# EAGLE design Core-ESP32 (EAGLE 7.7.0)

## Sheet 1 of 2
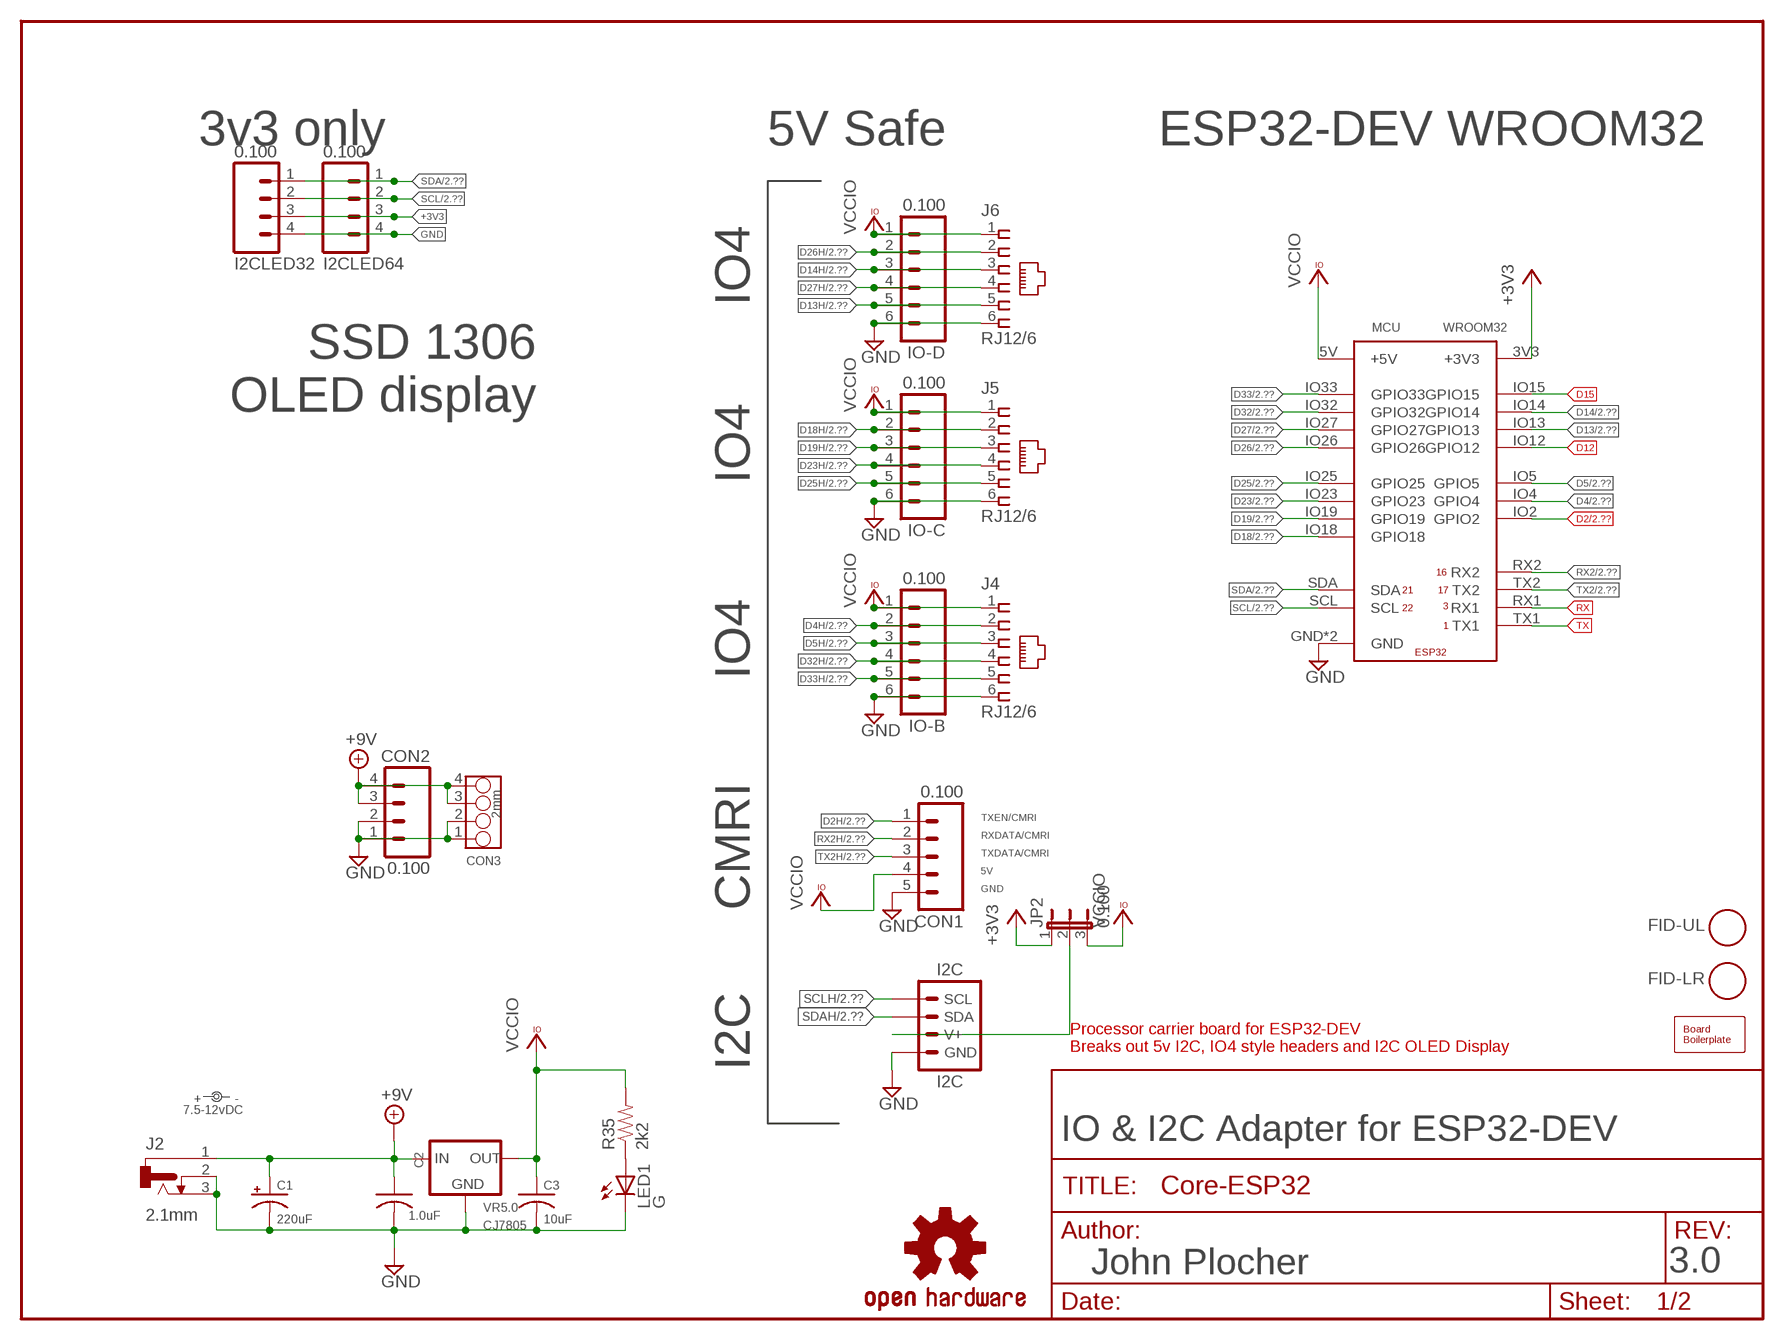
[diagram p0: schematic, sheet 1]

### Parts
BOARD  BOARD  BOARD80X100-IOB  [BOARD-DINRAIL-3.17IN-IOB]
C1  220uF  CAP-POL0810  [0810-CAP]
C2  1.0uF  CAP0603  [0603-CAP]
C3  10uF  CAP0603  [0603-CAP]
CON1  0.100  CONNECTOR-M05LOCK  [1X05_LOCK]
CON2  0.100  CONNECTOR-M04LOCK  [1X04_LOCK]
CON3  2mm  CONNECTOR-GROVE-4P-2.0-3470130P1  [4P-2.0]
FID-LR  FIDUCIAL  [FIDUCIAL_1MM]
FID-UL  FIDUCIAL  [FIDUCIAL_1MM]
I2C  I2C  CONNECTOR-I2CLEFT  [I2C-L]
I2CLED32  0.100  CONNECTOR-M04LOCK  [1X04_LOCK]
I2CLED64  0.100  CONNECTOR-M04LOCK  [1X04_LOCK]
IO-B  0.100  CONNECTOR-M06LOCK  [1X06_LOCK]
IO-C  0.100  CONNECTOR-M06LOCK  [1X06_LOCK]
IO-D  0.100  CONNECTOR-M06LOCK  [1X06_LOCK]
J2  2.1mm  CONNECTOR-DC-POWER-RA  [DCJ0202]
J4  RJ12/6  CONNECTOR-RJ25-43860-2-MOLEX  [RJ25-INVERTED]
J5  RJ12/6  CONNECTOR-RJ25-43860-2-MOLEX  [RJ25-INVERTED]
J6  RJ12/6  CONNECTOR-RJ25-43860-2-MOLEX  [RJ25-INVERTED]
JP2  0.100  JUMPER-3PTH-LOCK  [1X03]
LABEL1  7.5-12vDC  DOC-POWER_LABEL  [PWR_LABEL]
LED1  G  LED0603-LED  [0603-LED]
MCU  WROOM32  ESP32/DEV  [ESP32-DEV]
OSHW1  OSHW  OSHW-LOGOL  [OSHW-LOGO-L]
R35  2k2  R0603-RES  [0603-RES]
VR5.0  CJ7805  VREG-DPAK-5  [TO-252]

### Nets
+3V3: I2CLED32.3 I2CLED64.3 JP2.1 MCU.3V3(+3V3) ; also sheet 2
+9V [Feed]: C1.+ C2.1 CON2.3 CON2.4 CON3.3 CON3.4 J2.1 VR5.0.1(IN)
D2 [signals]: MCU.IO2(GPIO2) ; also sheet 2
D2H [signals]: CON1.1 ; also sheet 2
D4 [signals]: MCU.IO4(GPIO4) ; also sheet 2
D4H [signals]: IO-B.2 J4.2 ; also sheet 2
D5 [signals]: MCU.IO5(GPIO5) ; also sheet 2
D5H [signals]: IO-B.3 J4.3 ; also sheet 2
D12 [signals]: MCU.IO12(GPIO12)
D13 [signals]: MCU.IO13(GPIO13) ; also sheet 2
D13H [signals]: IO-D.5 J6.5 ; also sheet 2
D14 [signals]: MCU.IO14(GPIO14) ; also sheet 2
D14H [signals]: IO-D.3 J6.3 ; also sheet 2
D15 [signals]: MCU.IO15(GPIO15)
D18: MCU.IO18(GPIO18) ; also sheet 2
D18H [signals]: IO-C.2 J5.2 ; also sheet 2
D19: MCU.IO19(GPIO19) ; also sheet 2
D19H [signals]: IO-C.3 J5.3 ; also sheet 2
D23: MCU.IO23(GPIO23) ; also sheet 2
D23H [signals]: IO-C.4 J5.4 ; also sheet 2
D25 [signals]: MCU.IO25(GPIO25) ; also sheet 2
D25H [signals]: IO-C.5 J5.5 ; also sheet 2
D26 [signals]: MCU.IO26(GPIO26) ; also sheet 2
D26H [signals]: IO-D.2 J6.2 ; also sheet 2
D27 [signals]: MCU.IO27(GPIO27) ; also sheet 2
D27H [signals]: IO-D.4 J6.4 ; also sheet 2
D32: MCU.IO32(GPIO32) ; also sheet 2
D32H [signals]: IO-B.4 J4.4 ; also sheet 2
D33: MCU.IO33(GPIO33) ; also sheet 2
D33H [signals]: IO-B.5 J4.5 ; also sheet 2
GND [signals]: C1.- C2.2 C3.2 CON1.5 CON2.1 CON2.2 CON3.1 CON3.2 I2C.GND I2C.GND@1(GND) I2CLED32.4 I2CLED64.4 IO-B.6 IO-C.6 IO-D.6 J2.2 J2.3 J4.6 J5.6 J6.6 LED1.C MCU.GND MCU.GND@1(GND) VR5.0.2(GND)
N$1: LED1.A R35.1
N$3 [Power]: I2C.V+ I2C.V+@1(V+) JP2.2
RX [signals]: MCU.RX1
RX2 [signals]: MCU.RX2 ; also sheet 2
RX2H [signals]: CON1.2 ; also sheet 2
SCL [signals]: I2CLED32.2 I2CLED64.2 MCU.SCL ; also sheet 2
SCLH [signals]: I2C.SCL I2C.SCL@1(SCL) ; also sheet 2
SDA [signals]: I2CLED32.1 I2CLED64.1 MCU.SDA ; also sheet 2
SDAH [signals]: I2C.SDA I2C.SDA@1(SDA) ; also sheet 2
TX [signals]: MCU.TX1
TX2 [signals]: MCU.TX2 ; also sheet 2
TX2H [signals]: CON1.3 ; also sheet 2
VCCIO [Power]: C3.1 CON1.4 IO-B.1 IO-C.1 IO-D.1 J4.1 J5.1 J6.1 JP2.3 MCU.5V(+5V) R35.2 VR5.0.3(OUT) ; also sheet 2

### Notes on the sheet
- 3v3 only | 5V Safe | ESP32-DEV WROOM32
- IO4
- SSD 1306
  OLED display
- IO4
- IO4
- TXEN/CMRI
- RXDATA/CMRI
- TXDATA/CMRI
- 5V
- GND
- CMRI
- Processor carrier board for ESP32-DEV
  Breaks out 5v I2C, IO4 style headers and I2C OLED Display
- I2C
- IO & I2C Adapter for ESP32-DEV
- John Plocher | 3.0

## Sheet 2 of 2
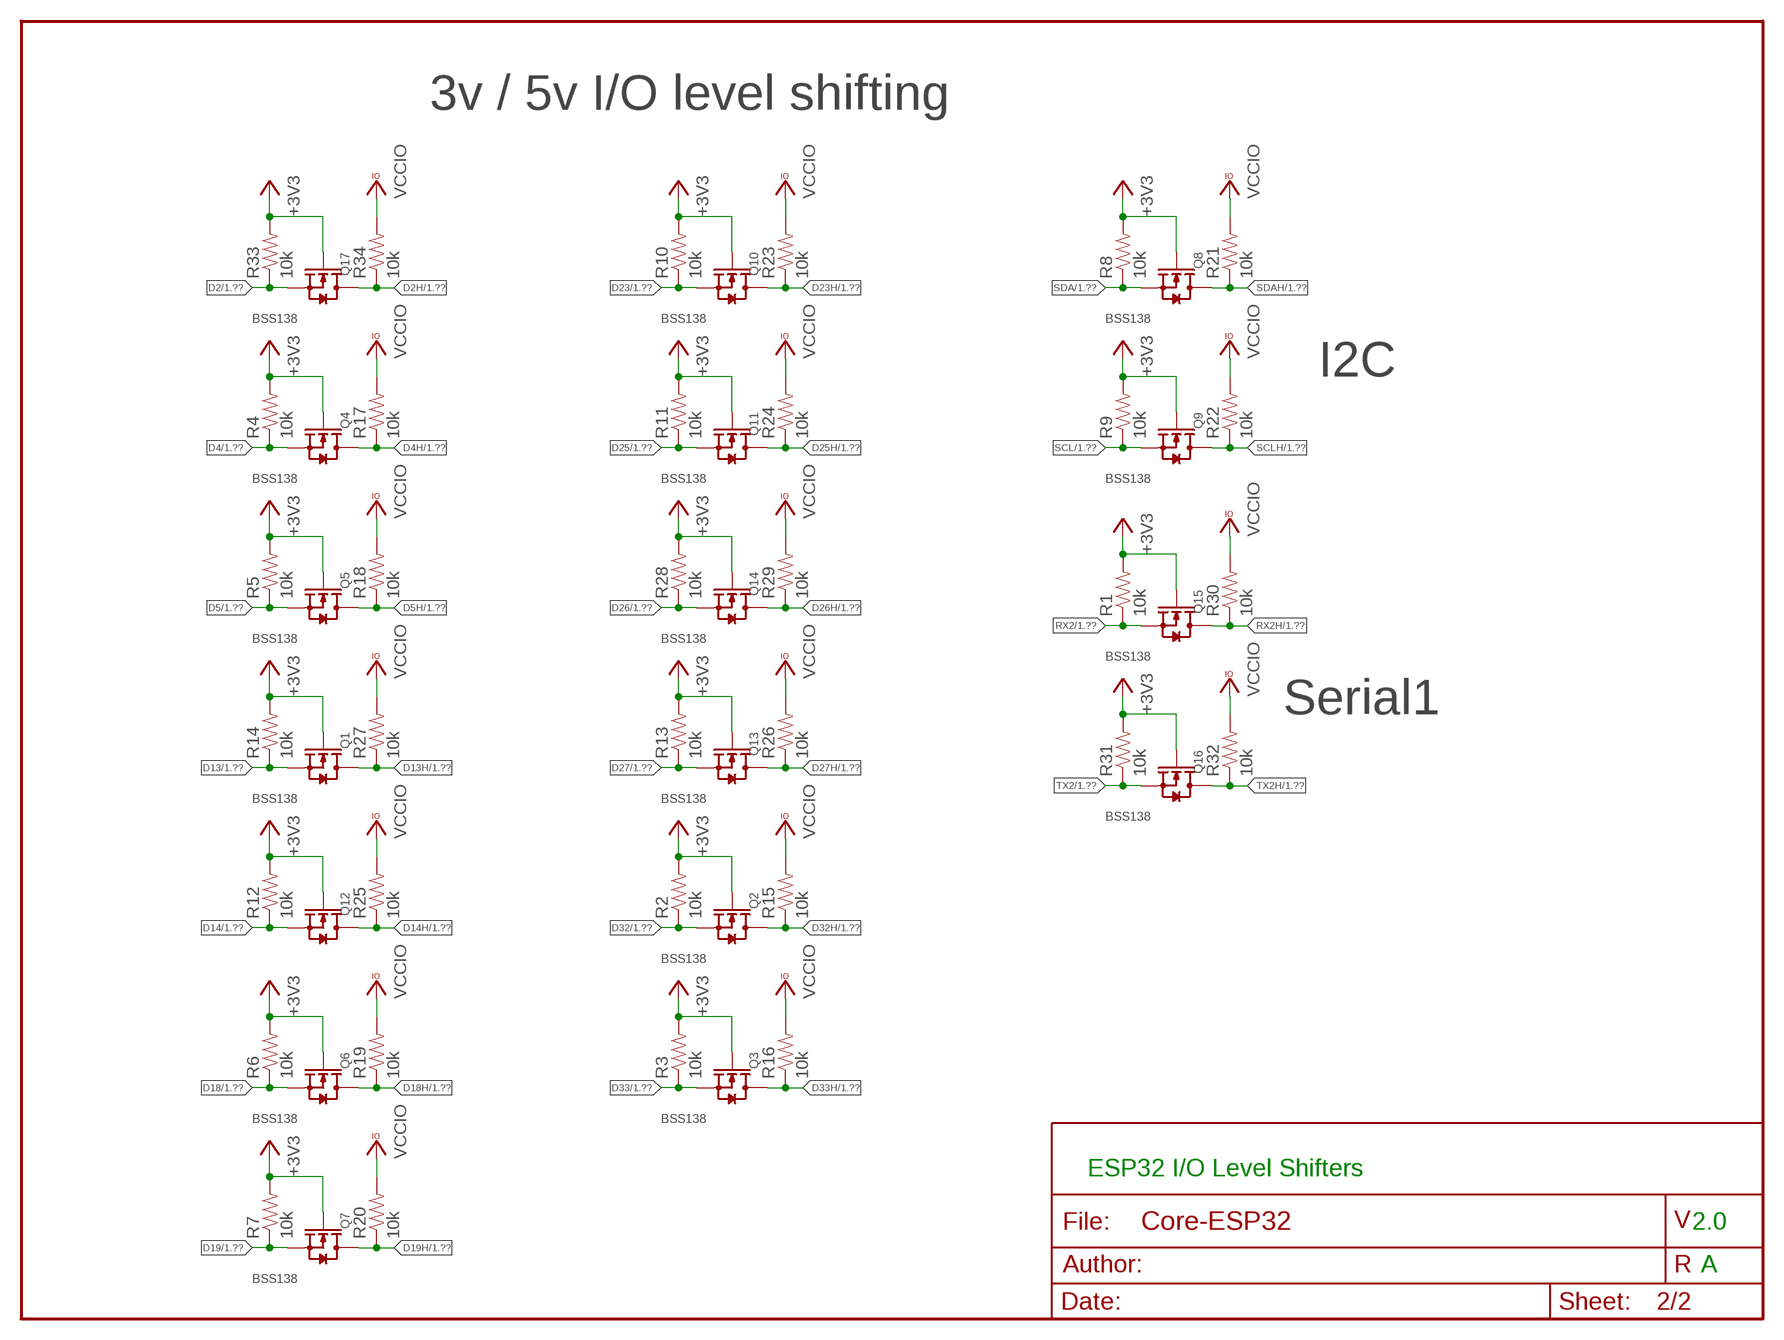
[diagram p1: schematic, sheet 2]

### Parts
Q1  BSS138  MOSFET-N-BSS138-SOT23  [SOT23]
Q2  BSS138  MOSFET-N-BSS138-SOT23  [SOT23]
Q3  BSS138  MOSFET-N-BSS138-SOT23  [SOT23]
Q4  BSS138  MOSFET-N-BSS138-SOT23  [SOT23]
Q5  BSS138  MOSFET-N-BSS138-SOT23  [SOT23]
Q6  BSS138  MOSFET-N-BSS138-SOT23  [SOT23]
Q7  BSS138  MOSFET-N-BSS138-SOT23  [SOT23]
Q8  BSS138  MOSFET-N-BSS138-SOT23  [SOT23]
Q9  BSS138  MOSFET-N-BSS138-SOT23  [SOT23]
Q10  BSS138  MOSFET-N-BSS138-SOT23  [SOT23]
Q11  BSS138  MOSFET-N-BSS138-SOT23  [SOT23]
Q12  BSS138  MOSFET-N-BSS138-SOT23  [SOT23]
Q13  BSS138  MOSFET-N-BSS138-SOT23  [SOT23]
Q14  BSS138  MOSFET-N-BSS138-SOT23  [SOT23]
Q15  BSS138  MOSFET-N-BSS138-SOT23  [SOT23]
Q16  BSS138  MOSFET-N-BSS138-SOT23  [SOT23]
Q17  BSS138  MOSFET-N-BSS138-SOT23  [SOT23]
R1  10k  R0603-RES  [0603-RES]
R2  10k  R0603-RES  [0603-RES]
R3  10k  R0603-RES  [0603-RES]
R4  10k  R0603-RES  [0603-RES]
R5  10k  R0603-RES  [0603-RES]
R6  10k  R0603-RES  [0603-RES]
R7  10k  R0603-RES  [0603-RES]
R8  10k  R0603-RES  [0603-RES]
R9  10k  R0603-RES  [0603-RES]
R10  10k  R0603-RES  [0603-RES]
R11  10k  R0603-RES  [0603-RES]
R12  10k  R0603-RES  [0603-RES]
R13  10k  R0603-RES  [0603-RES]
R14  10k  R0603-RES  [0603-RES]
R15  10k  R0603-RES  [0603-RES]
R16  10k  R0603-RES  [0603-RES]
R17  10k  R0603-RES  [0603-RES]
R18  10k  R0603-RES  [0603-RES]
R19  10k  R0603-RES  [0603-RES]
R20  10k  R0603-RES  [0603-RES]
R21  10k  R0603-RES  [0603-RES]
R22  10k  R0603-RES  [0603-RES]
R23  10k  R0603-RES  [0603-RES]
R24  10k  R0603-RES  [0603-RES]
R25  10k  R0603-RES  [0603-RES]
R26  10k  R0603-RES  [0603-RES]
R27  10k  R0603-RES  [0603-RES]
R28  10k  R0603-RES  [0603-RES]
R29  10k  R0603-RES  [0603-RES]
R30  10k  R0603-RES  [0603-RES]
R31  10k  R0603-RES  [0603-RES]
R32  10k  R0603-RES  [0603-RES]
R33  10k  R0603-RES  [0603-RES]
R34  10k  R0603-RES  [0603-RES]

### Nets
+3V3: Q1.1(G) Q2.1(G) Q3.1(G) Q4.1(G) Q5.1(G) Q6.1(G) Q7.1(G) Q8.1(G) Q9.1(G) Q10.1(G) Q11.1(G) Q12.1(G) Q13.1(G) Q14.1(G) Q15.1(G) Q16.1(G) Q17.1(G) R1.2 R2.2 R3.2 R4.2 R5.2 R6.2 R7.2 R8.2 R9.2 R10.2 R11.2 R12.2 R13.2 R14.2 R28.2 R31.2 R33.2 ; also sheet 1
D2 [signals]: Q17.2(S) R33.1 ; also sheet 1
D2H [signals]: Q17.3(D) R34.1 ; also sheet 1
D4 [signals]: Q4.2(S) R4.1 ; also sheet 1
D4H [signals]: Q4.3(D) R17.1 ; also sheet 1
D5 [signals]: Q5.2(S) R5.1 ; also sheet 1
D5H [signals]: Q5.3(D) R18.1 ; also sheet 1
D13 [signals]: Q1.2(S) R14.1 ; also sheet 1
D13H [signals]: Q1.3(D) R27.1 ; also sheet 1
D14 [signals]: Q12.2(S) R12.1 ; also sheet 1
D14H [signals]: Q12.3(D) R25.1 ; also sheet 1
D18: Q6.2(S) R6.1 ; also sheet 1
D18H [signals]: Q6.3(D) R19.1 ; also sheet 1
D19: Q7.2(S) R7.1 ; also sheet 1
D19H [signals]: Q7.3(D) R20.1 ; also sheet 1
D23: Q10.2(S) R10.1 ; also sheet 1
D23H [signals]: Q10.3(D) R23.1 ; also sheet 1
D25 [signals]: Q11.2(S) R11.1 ; also sheet 1
D25H [signals]: Q11.3(D) R24.1 ; also sheet 1
D26 [signals]: Q14.2(S) R28.1 ; also sheet 1
D26H [signals]: Q14.3(D) R29.1 ; also sheet 1
D27 [signals]: Q13.2(S) R13.1 ; also sheet 1
D27H [signals]: Q13.3(D) R26.1 ; also sheet 1
D32: Q2.2(S) R2.1 ; also sheet 1
D32H [signals]: Q2.3(D) R15.1 ; also sheet 1
D33: Q3.2(S) R3.1 ; also sheet 1
D33H [signals]: Q3.3(D) R16.1 ; also sheet 1
RX2 [signals]: Q15.2(S) R1.1 ; also sheet 1
RX2H [signals]: Q15.3(D) R30.1 ; also sheet 1
SCL [signals]: Q9.2(S) R9.1 ; also sheet 1
SCLH [signals]: Q9.3(D) R22.1 ; also sheet 1
SDA [signals]: Q8.2(S) R8.1 ; also sheet 1
SDAH [signals]: Q8.3(D) R21.1 ; also sheet 1
TX2 [signals]: Q16.2(S) R31.1 ; also sheet 1
TX2H [signals]: Q16.3(D) R32.1 ; also sheet 1
VCCIO [Power]: R15.2 R16.2 R17.2 R18.2 R19.2 R20.2 R21.2 R22.2 R23.2 R24.2 R25.2 R26.2 R27.2 R29.2 R30.2 R32.2 R34.2 ; also sheet 1

### Notes on the sheet
- 3v / 5v I/O level shifting
- I2C
- Serial1
- ESP32 I/O Level Shifters
- 2.0
- A

## Library data of the parts
BOARD = SPCoast:BOARD
C1 = SPCoast:CAP-POL*
C2 C3 = SPCoast:CAP*
CON1 = SPCoast:CONNECTOR-M05: Header 5 Standard 5-pin 0.1" header. Use with straight break away headers (SKU : PRT-00116), right angle break away headers (PRT-00553), swiss pins (PRT-00743), machine pins (PRT-00117), and female headers (PRT-00115). Molex polarized connector foot print use with SKU : PRT-08230 with associated crimp pins and housings.
CON2 I2CLED32 I2CLED64 = SPCoast:CONNECTOR-M04: Header 4 Standard 4-pin 0.1" header. Use with straight break away headers (SKU : PRT-00116), right angle break away headers (PRT-00553), swiss pins (PRT-00743), machine pins (PRT-00117), and female headers (PRT-00115). Molex polarized connector foot print use with SKU : PRT-08231 with associated crimp pins and housings. 1MM SMD Version SKU: PRT-10208
CON3 = SPCoast:CONNECTOR-GROVE-4P-2.0
FID-LR FID-UL = SPCoast:FIDUCIAL: For use by pick and place machines to calibrate the vision/machine, 1mm By microbuilder.eu
I2C = SPCoast:CONNECTOR-I2C
IO-B IO-C IO-D = SPCoast:CONNECTOR-M06: Header 6 Standard 6-pin 0.1" header
J2 = SPCoast:CONNECTOR-DC-POWER: DC POWER JACK
J4-J6 = SPCoast:CONNECTOR-RJ25: AMP connector
JP2 = SPCoast:JUMPER-3
LABEL1 = SPCoast:DOC-POWER_LABEL
LED1 = SPCoast:LED*
MCU = SPCoast:ESP32: https://www.banggood.com/ESP32-Development-Board-WiFiBluetooth-Ultra-Low-Power-Consumption-Dual-Cores-ESP-32-ESP-32S-Board-p-1109512.html
OSHW1 = SparkFun:OSHW-LOGO: Open Source Hardware Logo This logo indicates the piece of hardware it is found on incorporates a OSHW license and/or adheres to the definition of open source hardware found here: http://freedomdefined.org/OSHW
Q1-Q17 = SPCoast:MOSFET-N-*-?: CJ2302：SMD MOSFET N-CH 20V-2.1A DMN4468 - SO8 30v/10A
R1-R35 = SPCoast:R*: Resistor Basic schematic elements and footprints for 0603, 1206, and PTH 1/10th watt (small) resistors.
VR5.0 = SPCoast:VREG-?-*: Voltage Regulator Standard linear regulator. 7805 uses IGO pinout LM1117 uses GOI pinout

## Net classes
0 default: width 0.203 mm, drill 0.5 mm, clearance 0.203 mm
1 Power: width 0.406 mm, drill 0.8 mm, clearance 0.254 mm
2 signals: width 0.254 mm, drill 0.6 mm, clearance 0.254 mm
3 Feed: width 1.016 mm, drill 1.4 mm, clearance 0.254 mm

## Board
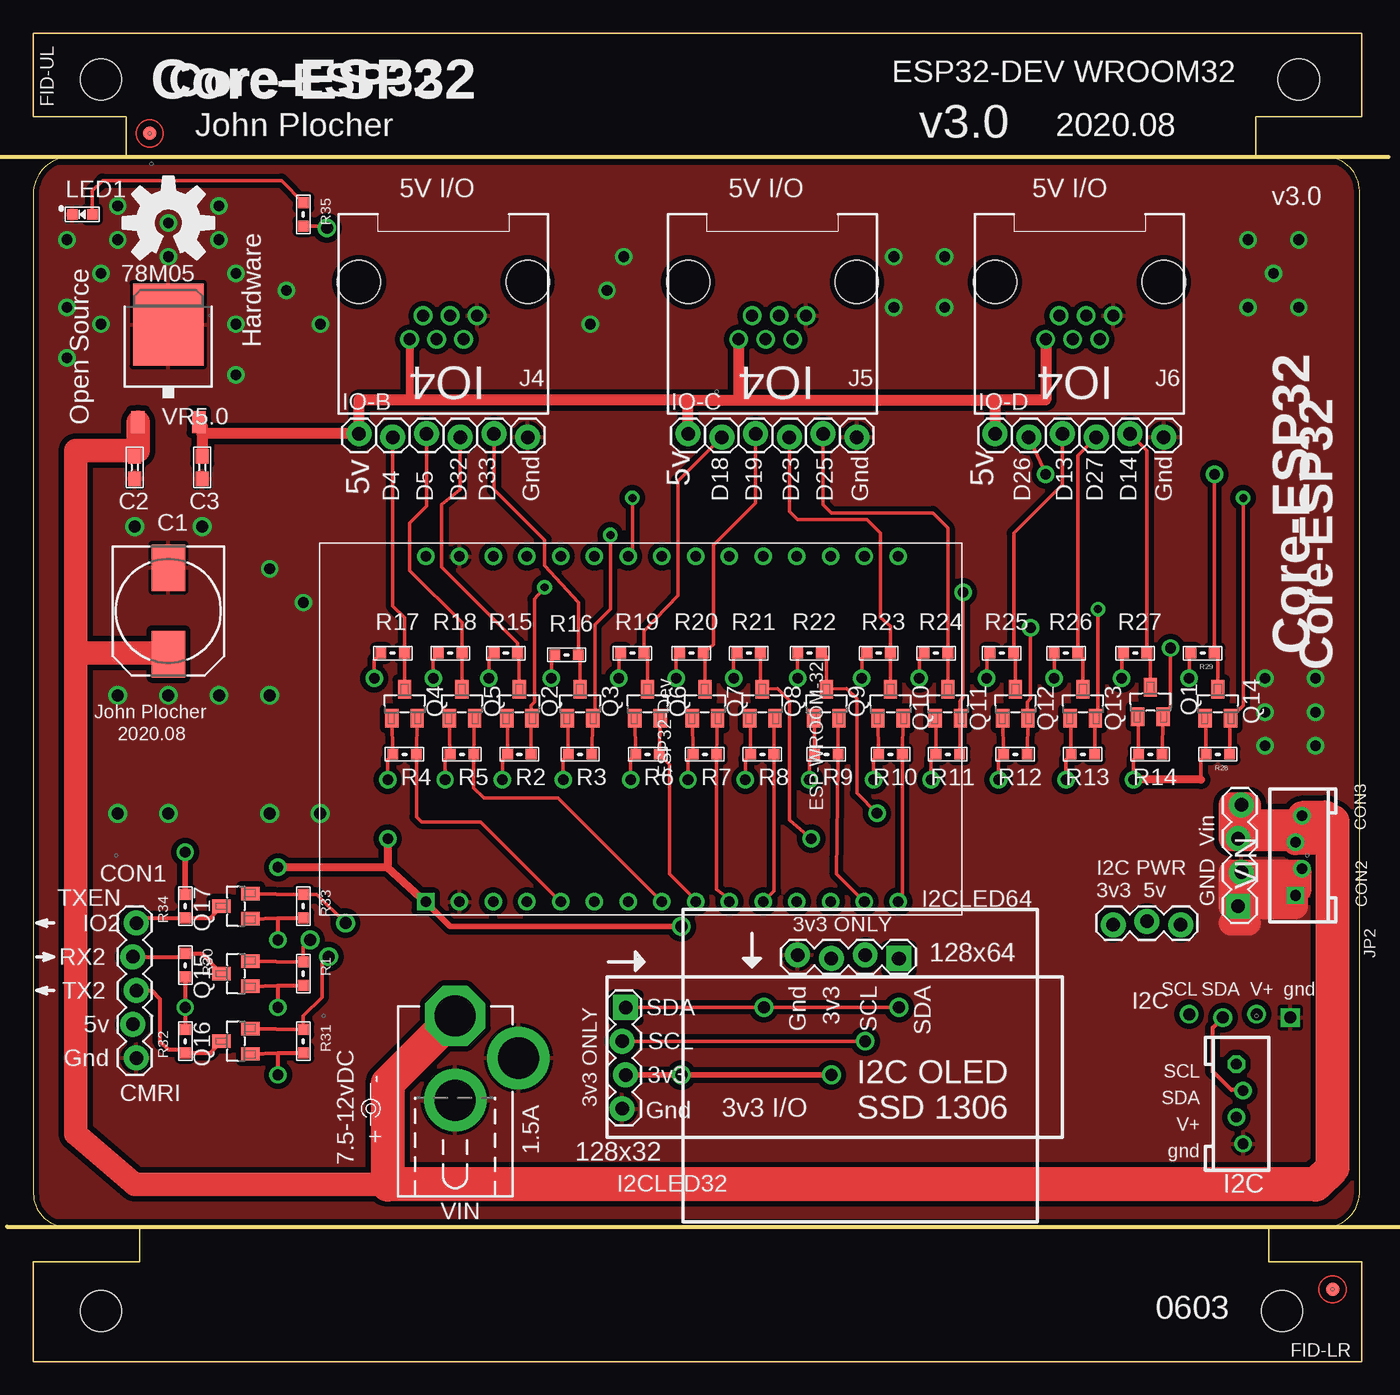
[diagram p2: board, top side]
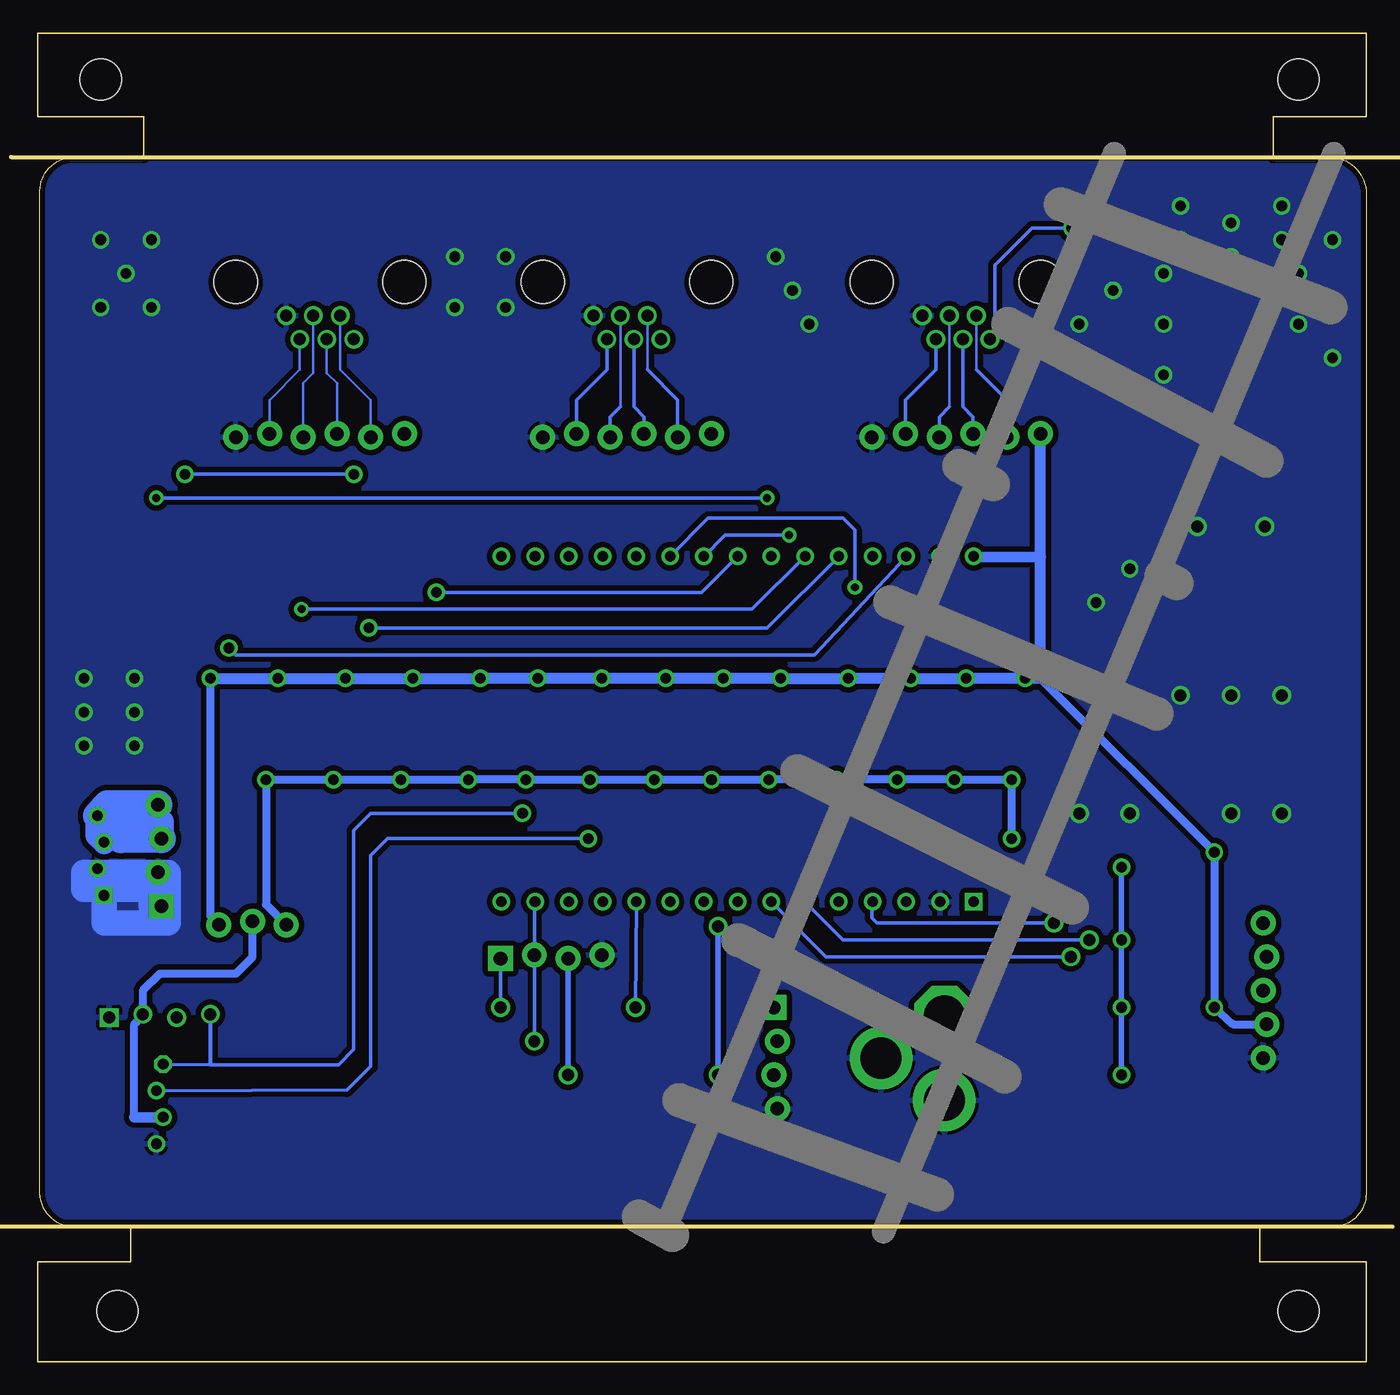
[diagram p3: board, bottom side, seen from below]

Size 100.01 x 100 mm. Coordinates in mm from the lower left corner, seen from the top.
Copper layers (1*16): Top 0.035mm / dielectric 1.5mm / Bottom 0.035mm
Design rules "Fusion_eagle_rule_v1.1 *": minimum track width 8mil, minimum drill 0.6mm, track to track 6mil, track to pad 6mil, pad to pad 10mil, via to via 10mil, smd to smd 10mil, copper to edge 10mil, drill to drill 10mil, minimum pad ring 10mil, minimum via ring 10mil, stop-mask expansion 2mil, vias tented up to drill 100mil, thermal gap 10mil

### Footprints (pad centres in the part's own frame; a part is rotated, then mirrored left to right if it is on the bottom)
BOARD-DINRAIL-3.17IN-IOB = hole 3.1: 5.08,96.52; 95.25,96.52; 5.08,3.81; 93.98,3.81
0810-CAP = smd 3.5 x 2.5: + 3.25,0; - -3.25,0
0603-CAP = smd 1.1 x 1: 1 -0.85,0; 2 0.85,0
1X05_LOCK = drill 1.016 pad 1.88: 1 0,0.127; 2 2.54,-0.127; 3 5.08,0.127; 4 7.62,-0.127; 5 10.16,0.127
1X04_LOCK = drill 1.016 pad 1.88 square: 1 0,0.127 | drill 1.016 pad 1.88: 2 2.54,-0.127; 3 5.08,0.127; 4 7.62,-0.127
4P-2.0 = drill 0.8 pad 1.27 square: 1 -3,0.254 | drill 0.8 pad 1.27: 2 -1,-0.254; 3 1,0.254; 4 3,-0.254
FIDUCIAL_1MM = smd 1 x 1: 1 0,0
I2C-L = drill 0.9 square: GND 3.81,-0.127 | drill 0.8 pad 1.27: GND@1 0.254,-9.635; SDA@1 0.254,-5.635; V+@1 -0.254,-7.635 | drill 0.9: SCL -3.81,0.127; SDA -1.27,-0.127; V+ 1.27,0.127 | drill 0.8 pad 1.27 octagon: SCL@1 -0.254,-3.635
1X06_LOCK = drill 1.016 pad 1.88: 1 0,0; 2 2.54,-0.254; 3 5.08,0; 4 7.62,-0.254; 5 10.16,0; 6 12.7,-0.254
DCJ0202 = drill 3.1 pad 4.5 octagon: 1 0,3.175 | drill 3.1 pad 4.7: 2 4.763,0; 3 0,-3.175
RJ25-INVERTED = drill 0.9 pad 1.4: 1 2.54,4.318; 2 1.524,2.54; 3 0.508,4.318; 4 -0.508,2.54; 5 -1.524,4.318; 6 -2.54,2.54 | hole 3.251: -6.35,0; 6.35,0
1X03 = drill 1.016 pad 1.88: 1 0,-0.127; 2 2.54,0.127; 3 5.08,-0.127
0603-LED = smd 0.8 x 0.8: A 0.75,0; C -0.75,0
ESP32-DEV = drill 0.8 square: 3V3 13,-20 | drill 0.8: 5V -13,-20; EN -13,15.56; GND -13,-17.46; GND@1 13,-17.46; IO2 13,-12.38; IO4 13,-9.84; IO5 13,-2.22; IO12 -13,-12.38; IO13 -13,-14.92; IO14 -13,-9.84; IO15 13,-14.92; IO18 13,0.32; IO19 13,2.86; IO23 13,15.56; IO25 -13,-2.22; IO26 -13,-4.76; IO27 -13,-7.3; IO32 -13,2.86; IO33 -13,0.32; IO34 -13,7.94; IO35 -13,5.4; RX1 13,7.94; RX2 13,-7.3; SCL 13,13.02; SDA 13,5.4; TX1 13,10.48; TX2 13,-4.76; VN -13,10.48; VP -13,13.02
SOT23 = smd 1.4 x 1: 1 1.1,-0.95; 2 1.1,0.95; 3 -1.1,0
0603-RES = smd 0.813 x 0.813: 1 -0.889,0; 2 0.889,0
TO-252 = smd 1.651 x 1.016: 1 -4.826,2.286; 3 -4.826,-2.286 | smd 6.2 x 5.3: 2 2.5,0

### Placement (x,y rotation side)
BOARD  0.01,0 0 top
C1  10.17,56.52 270 top
C2  7.63,67.31 270 top
C3  12.71,67.31 270 top
CON1  7.63,33.02 270 top
CON2  90.82,34.29 90 top
CON3  95.26,38.1 90 top
FID-LR  97.8,5.46 0 top
FID-UL  8.78,92.46 0 top
I2C  90.82,26.04 0 top
I2CLED32  44.46,26.67 270 top
I2CLED64  65.16,30.48 180 top
IO-B  24.52,69.85 0 top
IO-C  49.29,69.85 0 top
IO-D  72.4,69.85 0 top
J2  31.76,22.86 0 top
J4  30.87,81.28 180 top
J5  55.64,81.28 180 top
J6  78.75,81.28 180 top
JP2  81.29,33.02 0 top
LABEL1  25.41,19.05 180 top
LED1  3.7,86.36 0 top
MCU  49.54,47.62 270 top
OSHW1  10.17,85.72 0 top
Q1  84.09,49.66 270 top
Q2  36.59,49.53 270 top
Q3  41.16,49.53 270 top
Q4  27.95,49.53 270 top
Q5  32.27,49.53 270 top
Q6  46.24,49.53 270 top
Q7  50.56,49.53 270 top
Q8  54.88,49.53 270 top
Q9  59.7,49.53 270 top
Q10  64.53,49.53 270 top
Q11  68.85,49.53 270 top
Q12  73.93,49.53 270 top
Q13  79.01,49.53 270 top
Q14  89.17,49.53 270 top
Q15  15.25,29.21 0 top
Q16  15.25,24.13 0 top
Q17  15.25,34.29 0 top
R1  20.33,29.21 270 top
R2  36.59,45.72 180 top
R3  41.16,45.72 180 top
R4  27.95,45.72 180 top
R5  32.27,45.72 180 top
R6  46.24,45.72 180 top
R7  50.56,45.72 180 top
R8  54.88,45.72 180 top
R9  59.7,45.72 180 top
R10  64.53,45.72 180 top
R11  68.85,45.72 180 top
R12  73.93,45.72 180 top
R13  79.01,45.72 180 top
R14  84.09,45.72 180 top
R15  35.57,53.34 180 top
R16  40.15,53.21 180 top
R17  27.06,53.34 180 top
R18  31.38,53.34 180 top
R19  45.1,53.34 180 top
R20  49.54,53.34 180 top
R21  53.86,53.34 180 top
R22  58.43,53.34 180 top
R23  63.64,53.34 180 top
R24  67.96,53.34 180 top
R25  72.91,53.34 180 top
R26  77.74,53.34 180 top
R27  82.94,53.34 180 top
R28  89.17,45.72 180 top
R29  88.02,53.34 180 top
R30  11.44,29.84 270 top
R31  20.33,24.13 270 top
R32  11.44,24.13 90 top
R33  20.33,34.29 270 top
R34  11.44,34.29 90 top
R35  20.33,86.36 270 top
VR5.0  10.17,75.56 90 top

### Tracks (layer width: path | path; a pad name or v marks a point on that pad's centre or on a via)
+3V3  (via drill 0.8, 0.9)
  Top 0.254: Q12.1 R12.2 72.66,45.34 v72.66,43.81 | Q2.1 35.7,48.39 R2.2 35.32,45.34 v35.32,43.81 | Q1.1 83.2,48.51 R14.2 82.82,45.34 v82.82,43.81 | Q13.1 78.12,49.02 R13.2 77.74,45.34 v77.74,43.81 | Q8.1 53.99,48.39 R8.2 53.61,45.34 v53.61,43.81 | Q9.1 58.81,48.39 R9.2 58.43,45.34 v58.43,43.81 | Q11.1 67.96,48.39 R11.2 67.58,45.34 v67.58,43.81 | Q3.1 40.27,48.39 R3.2 39.89,45.34 v39.89,43.81 | Q4.1 R4.2 26.68,45.34 v26.68,43.81 | Q5.1 R5.2 31,45.34 v31,43.81 | Q6.1 R6.2 44.97,45.34 v44.97,43.81 | Q7.1 R7.2 49.29,45.34 v49.29,43.81 | Q10.1 R10.2 63.26,45.34 v63.26,43.81 | 87.9,43.81 87.9,45.34 R28.2 88.28,48.39 Q14.1
  Top 0.305: Q15.1 18.43,28.32 | 18.43,28.32 20.21,28.32 R1.2 | Q17.1 18.43,33.4 | 18.43,33.4 20.21,33.4 R33.2 | Q16.1 18.43,23.24 | 18.43,23.24 20.21,23.24 R31.2 | v18.43,21.59 18.43,23.24 | v18.43,26.67 18.43,28.32 | v18.43,31.75 18.43,33.4
  Top 0.406: MCU.3V3 31.38,32.77 v48.78,32.77 | I2CLED32.3 v48.78,21.59 v60.08,21.59
  Top 0.61: 87.9,43.81 v82.82,43.81 | 26.68,37.21 MCU.3V3 | v26.68,39.37 26.68,37.21 | 26.68,37.21 v18.43,37.21
  Bottom 0.406: v18.43,21.59 v18.43,26.67 v18.43,31.75 v18.43,37.21 | v60.08,21.59 I2CLED64.3 | v48.78,32.77 v48.78,21.59
  Bottom 0.61: v26.68,39.37 v26.68,43.81 v31,43.81 v35.32,43.81 v39.89,43.81 v44.97,43.81 v49.29,43.81 v53.61,43.81 v58.43,43.81 v63.26,43.81 v67.58,43.81 v72.66,43.81 v77.74,43.81 v82.82,43.81 82.82,34.42 JP2.1
+9V
  Top 0.406: C2.1 7.63,68.58
  Top 1.676: C1.+ 10.05,53.34 | 97.8,40.64 97.3,41.15
  Top 1.778: 3.19,53.34 3.19,17.14 7.63,13.34 26.68,13.34 | 3.19,53.34 3.19,68.58 7.63,68.58 7.89,68.58 VR5.0.1 | 10.05,53.34 3.19,53.34
  Top 1.93: CON3.3 97.55,39.12 97.8,39.37 90.18,39.37 90.18,41.91 91.45,41.91 91.45,40.64 95.26,40.64
  Top 2.184: 97.3,41.15 97.17,41.15 CON3.4
  Top 2.54: 97.8,40.64 97.8,39.37 97.8,14.61 96.53,13.34 26.68,13.34 26.68,20.95 J2.1
  Bottom 1.778: CON3.3 95.52,39.62 CON3.4
  Bottom 1.93: CON2.3 90.69,40.64 93.99,40.64
  Bottom 2.184: CON2.4 94.76,41.91 CON3.4 93.74,39.37 CON2.3
D2  (via drill 0.9)
  Top 0.254: R33.1 21.35,35.18 v23.51,33.02
  Top 0.305: Q17.2 20.21,35.18 R33.1
  Bottom 0.254: v23.51,33.02 36.84,33.02 37.22,33.4 MCU.IO2
D2H
  Top 0.305: CON1.1 8.14,33.4 R34.1 13.35,33.4 Q17.3
D4
  Top 0.254: Q4.2 R4.1 28.84,41.02 29.22,40.64 33.67,40.64 MCU.IO4
D4H
  Top 0.254: IO-B.2 27.06,56.9 27.95,56.01 R17.1 27.95,50.67 Q4.3
  Bottom 0.203: J4.2 29.35,74.68
  Bottom 0.254: 29.35,74.68 27.06,72.39 IO-B.2
D5
  Top 0.254: Q5.2 R5.1 33.16,43.18 33.92,42.42 39.51,42.42 MCU.IO5
D5H
  Top 0.254: Q5.3 32.27,51.56 R18.1 32.27,55.63 28.33,59.56 28.33,63.12 29.6,64.39 IO-B.3
  Bottom 0.254: J4.3 30.37,71.88 29.6,71.12 IO-B.3
D13  (via drill 0.8)
  Top 0.254: R14.1 Q1.2 85.61,49.28 v85.61,53.72
  Bottom 0.254: MCU.IO13 41.54,53.21 85.1,53.21 v85.61,53.72
D13H
  Top 0.254: Q1.3 84.09,52.83 R27.1 83.83,68.58 IO-D.5
  Bottom 0.203: J6.5 80.28,74.68 82.56,72.39 IO-D.5
D14  (via drill 0.8)
  Top 0.254: R12.1 Q12.2 74.82,49.66 75.07,49.91 v75.07,55.24
  Bottom 0.254: v75.07,55.24 45.1,55.24 MCU.IO14
D14H
  Top 0.254: Q12.3 73.93,53.21 R25.1 | R25.1 73.93,53.47 | IO-D.3 77.48,66.04 73.8,62.36 R25.1
  Bottom 0.203: J6.3 78.25,74.42 77.48,73.66 IO-D.3
D18
  Top 0.254: Q6.2 R6.1 47.89,44.96 47.89,36.7 49.8,34.8 MCU.IO18
D18H
  Top 0.254: Q6.3 46.24,53.21 R19.1 45.99,54.99 48.53,57.66 48.53,66.29 IO-C.2
  Bottom 0.203: J5.2 54.12,74.68
  Bottom 0.254: 54.12,74.68 51.83,72.39 IO-C.2
D19
  Top 0.254: Q7.2 R7.1 51.45,35.56 52.46,34.8 MCU.IO19
D19H
  Top 0.254: Q7.3 50.56,52.96 R20.1 | IO-C.3 54.37,64.64 51.19,61.47 51.19,53.98 R20.1 | 50.69,53.34 R20.1
  Bottom 0.254: J5.3 55.13,71.88 54.37,71.12 IO-C.3
D23
  Top 0.254: Q10.2 R10.1 65.42,35.18 MCU.IO23
D23H
  Top 0.254: Q10.3 64.53,51.94 R23.1 64.53,54.1 64.53,55.37 63.77,56.01 63.77,62.36 62.75,63.37 57.54,63.37 56.91,64.01 IO-C.4
  Bottom 0.203: J5.4 56.15,71.88
  Bottom 0.254: 56.15,71.88 56.91,71.12 IO-C.4
D25  (via drill 0.8)
  Top 0.254: R11.1 69.74,48.39 Q11.2 69.74,49.66 69.99,50.04 v69.99,57.91
  Bottom 0.254: v69.99,57.91 50.05,57.91 MCU.IO25
D25H
  Top 0.254: Q11.3 68.85,53.21 R24.1 68.85,58.67 68.85,62.74 67.7,63.88 60.08,63.88 59.45,64.52 IO-C.5
  Bottom 0.254: J5.5 57.16,74.68 59.45,72.39 IO-C.5
D26  (via drill 0.6)
  Top 0.254: R28.1 90.06,48.39 Q14.2 91.07,49.4 v91.07,65.02 | v45.1,65.02 45.1,60.96 MCU.IO26
  Bottom 0.254: v45.1,65.02 v91.07,65.02
D26H  (via drill 0.8)
  Top 0.254: Q14.3 89.17,53.09 R29.1 v88.91,66.8 | v76.21,66.8 IO-D.2
  Bottom 0.203: J6.2 77.23,74.68 74.94,72.39 IO-D.2
  Bottom 0.254: v76.21,66.8 v88.91,66.8
D27  (via drill 0.6)
  Top 0.254: R13.1 79.9,49.02 Q13.2 80.15,48.9 v80.15,56.64
  Bottom 0.254: MCU.IO27 46.24,56.64 v80.15,56.64
D27H
  Top 0.254: Q13.3 79.01,52.96 R26.1 78.63,68.2 IO-D.4
  Bottom 0.203: J6.4 79.26,74.42 80.02,73.66 IO-D.4
D32  (via drill 0.6)
  Top 0.254: R2.1 37.48,48.39 Q2.2 37.48,49.4 37.73,49.66 37.73,57.4 v38.49,58.29
  Bottom 0.254: MCU.IO32 49.54,63.5 39.38,63.5 38.49,62.61 v38.49,58.29
D32H
  Top 0.254: Q2.3 36.59,52.7 R15.1 36.46,54.1 30.75,59.82 30.75,64.52 32.14,65.66 IO-B.4
  Bottom 0.203: J4.4 31.38,71.88
  Bottom 0.254: 31.38,71.88 32.14,71.12 IO-B.4
D33  (via drill 0.6)
  Top 0.254: R3.1 Q3.2 42.3,48.64 42.3,55.5 43.45,56.64 v43.45,62.23
  Bottom 0.254: v43.45,62.23 48.27,62.23 MCU.IO33
D33H
  Top 0.254: Q3.3 41.16,53.09 R16.1 41.03,57.15 38.49,59.94 38.49,61.85 34.68,65.66 IO-B.5
  Bottom 0.254: J4.5 32.4,74.68 34.68,72.39 IO-B.5
GND  (via drill 0.8, 0.9)
  Top 1.93: CON3.1 95.01,34.29 CON2.1 | CON2.1 90.18,34.29 90.18,36.83 91.45,36.83 | 91.45,36.83 91.45,35.56 95.26,35.56 95.26,36.83 91.45,36.83 | CON2.1 90.69,33.02 | 90.69,33.02 90.18,33.02 | 90.69,33.02 91.45,33.02
  Bottom 1.93: CON3.1 95.01,33.02 90.18,33.02 90.18,36.83 96.53,36.83 96.53,35.56 91.45,35.56 91.45,34.29
  other vias: 15.25,74.3 15.25,78.11 15.25,81.92 5.09,78.11 5.09,81.92 10.17,83.19 13.98,87 6.36,87 19.06,80.64 2.55,79.38 21.6,78.11 2.55,84.45 6.36,84.45 13.98,84.45 10.17,85.72 2.55,75.56 12.71,62.87 7.63,62.87 17.79,41.27 21.6,41.27 10.17,41.27 6.36,41.27 6.36,50.16 10.17,50.16 17.79,50.16 13.98,50.16 95.26,79.38 91.45,79.38 93.36,81.92 95.26,84.45 91.45,84.45 92.72,51.44 96.53,51.44 96.53,48.9 96.53,46.35 92.72,46.35 92.72,48.9 64.78,83.19 64.78,79.38 68.59,79.38 68.59,83.19 44.46,83.19 43.19,80.64 41.92,78.11 20.33,57.15 17.79,59.69
  pour Bottom (isolate 0.406, rank 2): 100.34,10.9 100.34,90.17 0.01,90.17 0.01,10.9
  pour Top (isolate 0.406, rank 2): 100.34,10.9 100.34,89.92 0.01,89.92 0.01,10.9
N$1
  Top 0.254: LED1.A 4.45,88.13 4.46,88.14 5.22,88.9 18.68,88.9 R35.1
N$3
  Bottom 0.406: 92.09,26.04 I2C.V+
  Bottom 0.61: 92.72,18.41 92.72,25.4 92.09,26.04 | I2C.V+ 92.09,27.94 90.82,29.21 85.1,29.21 83.83,30.48 JP2.2
  Bottom 0.813: 92.72,18.41 I2C.V+@1
RX2  (via drill 0.9)
  Top 0.254: v20.84,31.75 20.33,31.24 R1.1
  Top 0.305: Q15.2 20.21,30.1 R1.1
  Bottom 0.254: v20.84,31.75 39.38,31.75 MCU.RX2
RX2H
  Top 0.305: CON1.2 11.06,30.48 R30.1 12.71,30.73 Q15.3
SCL  (via drill 0.9)
  Top 0.254: Q9.2 60.59,48.39 R9.1 60.59,45.09 60.47,36.7 61.35,35.81 MCU.SCL | v62.62,24.13 I2CLED32.2
  Bottom 0.254: MCU.SCL 62.62,34.67 I2CLED64.2 v62.62,24.13
SCLH  (via drill 0.8)
  Top 0.254: R22.1 59.7,53.09 Q9.3 61.23,50.67 61.99,49.91 61.99,42.8 v63.51,41.27
  Bottom 0.254: v63.51,41.27 74.94,41.27 76.21,40.01 76.21,23.5 77.36,22.35 87.01,22.35 I2C.SCL@1
  Bottom 0.305: I2C.SCL 87.01,22.35
SDA  (via drill 0.9)
  Top 0.254: Q8.2 55.77,48.39 R8.1 55.77,35.43 MCU.SDA | I2CLED32.1 v55,26.67 v65.16,26.67
  Bottom 0.254: MCU.SDA v55,26.67 | I2CLED64.1 v65.16,26.67
SDAH  (via drill 0.8)
  Top 0.254: v58.56,39.37 56.91,40.77 56.91,49.78 56.02,50.67 Q8.3 54.75,50.8 R21.1
  Top 0.305: I2C.SDA@1 91.07,20.45 90.18,20.45 88.79,21.84 88.79,25.15 I2C.SDA
  Top 0.406: I2C.SDA 89.68,25.91
  Bottom 0.254: v58.56,39.37 73.67,39.37 74.94,38.1 74.94,22.23 76.72,20.45 I2C.SDA@1
TX2  (via drill 0.9)
  Top 0.254: R31.1 20.33,26.04 21.73,27.43 21.73,29.97 v22.24,30.48
  Top 0.305: Q16.2 20.21,25.02 R31.1
  Bottom 0.254: v22.24,30.48 40.65,30.48 MCU.TX2
TX2H
  Top 0.305: CON1.3 8.9,27.94 9.54,27.3 9.54,24.13 10.17,23.5 11.19,23.5 R32.1 13.35,23.24 Q16.3
VCCIO  (via drill 0.8, 0.9)  (1 unrouted)
  Top 0.254: v30.11,51.44 30.11,52.83 R18.2 | v34.3,51.44 34.3,52.96 R15.2 | v39,51.44 39,52.83 R16.2 | R19.2 44.08,52.96 v44.08,51.44 | R20.2 48.4,53.21 v48.4,51.44 | R21.2 52.72,53.09 v52.72,51.44 | R22.2 57.54,52.07 v57.54,51.44 | R23.2 62.37,52.96 v62.37,51.44 | R24.2 66.69,52.96 v66.69,51.44 | R25.2 71.77,52.96 v71.77,51.44 | R26.2 76.85,52.96 v76.85,51.44 | R27.2 81.93,52.83 v81.93,51.44 | R29.2 87.01,52.96 v87.01,51.44 | R17.2 25.67,52.83 v25.67,51.44 | R35.2 21.98,85.47 v22.11,85.34
  Top 0.305: R30.2 v11.44,26.67 R32.2
  Top 0.406: R34.2 v11.44,38.35
  Top 0.61: J4.1 28.33,72.39 27.95,72.39
  Top 0.813: IO-C.1 49.29,72.39 | 49.29,72.39 27.95,72.39 24.52,72.39 IO-B.1 12.71,69.85 | 49.29,72.39 53.1,72.39 | 53.1,72.39 72.4,72.39 | J5.1 53.1,72.39 | 72.4,72.39 IO-D.1 | J6.1 76.21,72.39 72.4,72.39 | 12.71,70.48 12.71,69.85 | 12.71,69.85 C3.1
  Bottom 0.254: v22.11,85.34 25.16,85.34 27.95,82.55 27.95,77.34 J4.1
  Bottom 0.61: CON1.4 10.05,25.4 v11.44,26.67 v11.44,38.35 24.52,51.44 | v87.01,51.44 87.01,33.53 JP2.3
  Bottom 0.813: v87.01,51.44 v81.93,51.44 v76.85,51.44 v71.77,51.44 v66.69,51.44 v62.37,51.44 v57.54,51.44 v52.72,51.44 v48.4,51.44 v44.08,51.44 v39,51.44 v34.3,51.44 v30.11,51.44 v25.67,51.44 24.52,51.44 24.52,60.58 | 24.52,60.58 IO-B.1 | MCU.5V 24.52,60.58

### Text on the board
tPlace: ESP32-DEV WROOM32 | John Plocher | v3.0 | 2020.08 | 5V I/O | 5V I/O | 5V I/O | v3.0 | 78M05 | Hardware | IO4 | IO4 | IO4 | Open Source | 5v | 5v | 5v | D4 | D5 | D32 | D33 | Gnd | D18 | D19 | D23 | D25 | Gnd | D26 | D13 | D27 | D14 | Gnd | John Plocher | 2020.08 | TXEN / IO2 | VIN | I2C PWR / 3v3 5v | GND Vin | 3v3 ONLY | RX2 | 128x64 | TX2 | Gnd | 3v3 | SCL | SDA | 3v3 ONLY | 5v | SDA | Gnd | SCL | 3v3 | CMRI | Gnd | 3v3 I/O | I2C OLED / SSD 1306 | 1.5A | 128x32 | VIN | 0603
bDocu: IO4 breakout, I2C master, LCD display | Made in the PCR, Coast Division, NMRA | IO4 breakout, I2C master and LCD display | Go Bears! | For use with Geekcreit ESP32 / (dual 18-pin version) | www. SP Coast .com | Model Railroading is fun! | For use with Geekcreit ESP32 / (dual 18-pin version)